# Altium schematic sheet TPS5530RTE.SchDoc
size A
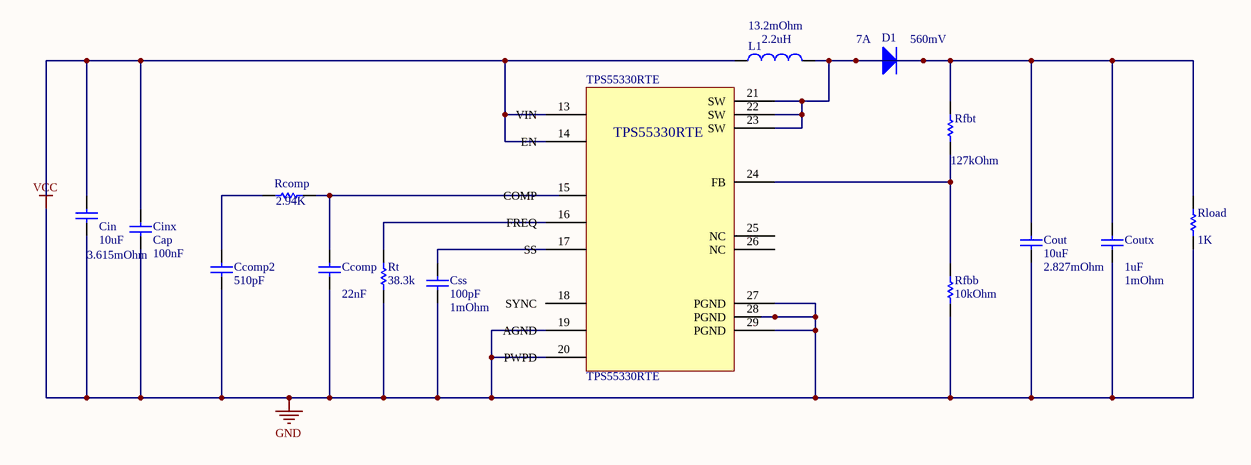
[diagram p0: TPS5530RTE.SchDoc]

## Parts
Capacitor?  Cin  value 10uF  res: 3.615mOhm  [RAD-0.3]
Ccomp  value 22nF  [RAD-0.3]  (hidden comment: Cap)
Ccomp2  value 510pF  [RAD-0.3]  (hidden comment: Cap)
Cinx  Cap  value 100nF  [RAD-0.3]
Cout  value 10uF  res: 2.827mOhm  [RAD-0.3]  (hidden comment: Cap)
Coutx  value 1uF  res: 1mOhm  [RAD-0.3]  (hidden comment: Cap)
Css  value 100pF  [RAD-0.3]  (hidden comment: Cap)
D1  v: 560mV  i: 7A  [SMC]  (hidden comment: Diode)
L1  value 2.2uH  Res: 13.2mOhm  [0402-A]  (hidden comment: Inductor)
Rcomp  value 2.94K  [AXIAL-0.3]  (hidden comment: Res1)
Rfbb  value 10kOhm  [AXIAL-0.3]  (hidden comment: Res1)
Rfbt  value 127kOhm  [AXIAL-0.3]  (hidden comment: Res1)
Rload  value 1K  [AXIAL-0.3]  (hidden comment: Res1)
Rt  value 38.3k  [AXIAL-0.3]  (hidden comment: Res1)
TPS55330RTE  TPS55330RTE

## Nets
GND: Capacitor?.2 Ccomp.1 Ccomp2.1 Cinx.1 Cout.1 Coutx.1 Css.1 Rfbb.1 Rload.2 Rt.1 TPS55330RTE.27(PGND) TPS55330RTE.28(PGND) TPS55330RTE.29(PGND)  [also labelled VCC]
NetCapacitor?_1: Capacitor?.1 Cinx.2 L1.1
NetCcomp2_2: Ccomp2.2 Rcomp.1
NetCcomp_2: Ccomp.2 Rcomp.2
NetCout_2: Cout.2 Coutx.2 D1.1(A) D1.2(K) L1.2 Rfbt.2 Rload.1 TPS55330RTE.21(SW) TPS55330RTE.22(SW) TPS55330RTE.23(SW)
NetRfbb_2: Rfbb.2 Rfbt.1 TPS55330RTE.24(FB)

Not connected (* = marked no-connect by the designer): Css 2; Rt 2; TPS55330RTE 13(VIN) 14(EN) 15(COMP) 16(FREQ) 17(SS) 18(SYNC) 19(AGND) 20(PWPD) 25(NC) 26(NC)

## Notes on the sheet
- (in symbol Cap) 1mOhm

## Library data of the parts
Capacitor? Ccomp Ccomp2 Cout Coutx Css = Cap: Capacitor; Published: 8-Jun-2000; LatestRevisionDate: 17-Jul-2002; LatestRevisionNote: Re-released for DXP Platform.; PackageReference: RAD-0.3; Publisher: Altium Limited; PackageDescription: Radial Cap, Thru-Hole; 2 Leads; 0.3 in Pin Spacing
Cinx = Cap: Capacitor; res: 1mOhm; Published: 8-Jun-2000; LatestRevisionDate: 17-Jul-2002; LatestRevisionNote: Re-released for DXP Platform.; PackageReference: RAD-0.3; Publisher: Altium Limited; PackageDescription: Radial Cap, Thru-Hole; 2 Leads; 0.3 in Pin Spacing
D1 = Diode: Default Diode; Published: 8-Jun-2000; LatestRevisionDate: 17-Jul-2002; LatestRevisionNote: Re-released for DXP Platform.; PackageVersion: Sep-1996; PackageReference: SMC; Publisher: Altium Limited; PackageDescription: DO-214-AB/SMC; 2 C-Bend Leads; Body 7.9 x 5.9 mm, inc. leads (LxW); Code_JEDEC: DO-214-AB
L1 = Inductor: Code_IEC: 1005; Published: 8-Jun-2000; LatestRevisionDate: 29-May-2009; LatestRevisionNote: IPC-7351 Footprint Added.; PackageReference: 0402-A; Publisher: Altium Limited; PackageDescription: Chip Inductor; Code_JEITA: 0402
Rcomp Rfbb Rfbt Rload Rt = Res1: Resistor; Published: 8-Jun-2000; LatestRevisionDate: 17-Jul-2002; LatestRevisionNote: Re-released for DXP Platform.; PackageReference: AXIAL-0.3; Publisher: Altium Limited; PackageDescription: Axial Device, Thru-Hole; 2 Leads; 0.3 in Pin Spacing